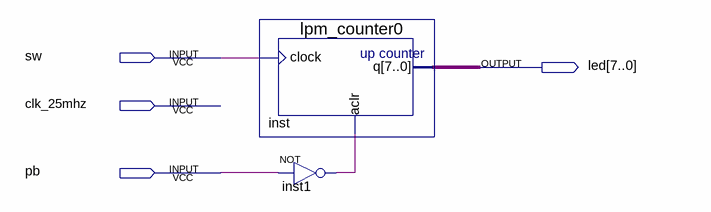
[diagram p0: schematic sheet]
// Quartus schematic lab_cb.bdf as structural Verilog: 2 symbols, 4 pins
module lab_cb (
  input  sw,
  input  clk_25mhz,
  input  pb,
  output [7:0] led
);

  wire inst1_out;

  lpm_counter0 inst (.clock(sw), .aclr(inst1_out), .q(led));
  not inst1 (inst1_out, pb);
endmodule
